# EAGLE design Terminierung_RS485-007 (EAGLE 7.6.0)
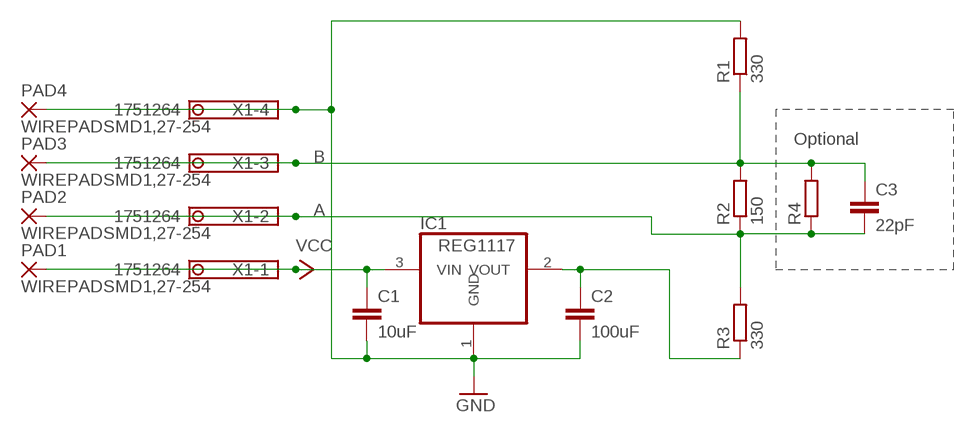
[diagram p0: schematic, sheet 1]

## Parts
C1  10uF  C-EUC0805K  [C0805K]
C2  100uF  C-EUC0805K  [C0805K]
C3  22pF  C-EUC0805K  [C0805K]
IC1  REG1117  [SOT223]
PAD1  WIREPADSMD1,27-254  [SMD1,27-2,54]
PAD2  WIREPADSMD1,27-254  [SMD1,27-2,54]
PAD3  WIREPADSMD1,27-254  [SMD1,27-2,54]
PAD4  WIREPADSMD1,27-254  [SMD1,27-2,54]
R1  330  R-EU_R0805  [R0805]
R2  150  R-EU_R0805  [R0805]
R3  330  R-EU_R0805  [R0805]
R4  R-EU_M1206  [M1206]
X1  1751264  [1751264]

## Nets
A: C3.2 PAD2.1(P) R2.1 R3.2 R4.1 X1.2
B: C3.1 PAD3.1(P) R1.1 R2.2 R4.2 X1.3
GND [Power]: C1.2 C2.2 IC1.1(GND) PAD4.1(P) R1.2 X1.4
N$2: C2.1 IC1.2(VOUT) R3.1
VCC [Power]: C1.1 IC1.3(VIN) PAD1.1(P) X1.1

## Notes on the sheet
- Optional

## Library data of the parts
C1-C3 = resistor:C-EU: CAPACITOR, European symbol
IC1 = burr-brown:REG1117: 800mA and 1A Low Dropout (LDO) Positive Regulator 1.8V, 2.5V, 2.85V, 3.3V, 5V, and Adj; MPN: REG1117; OC_FARNELL: 1097566; OC_NEWARK: 14P6981
PAD1-PAD4 = wirepad:WIREPAD: Wire PAD connect wire on PCB
R1-R4 = resistor:R-EU_: RESISTOR, European symbol
X1 = con-phoenix-350:1751264: MKDS 1/ 4-3,5 Printklemme Nennstrom: 10 A Bemessungsspannung: 160 V Raster: 3,5 mm Polzahl: 4 Montageart: Löten Anschlussart: Schraubanschluss Anschlussrichtung vom Leiter zur Platine: 0° Source: http://eshop.phoenixcontact.com .. 1751264.pdf; MF: VIN; MPN: 1751264; OC_FARNELL: unknown; OC_NEWARK: 10R0934

## Net classes
0 default: width 0.406 mm
1 Power: width 0.61 mm

## Board
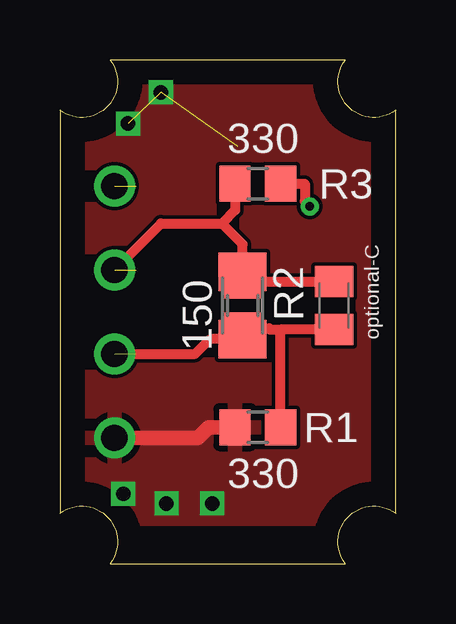
[diagram p1: board, top side]
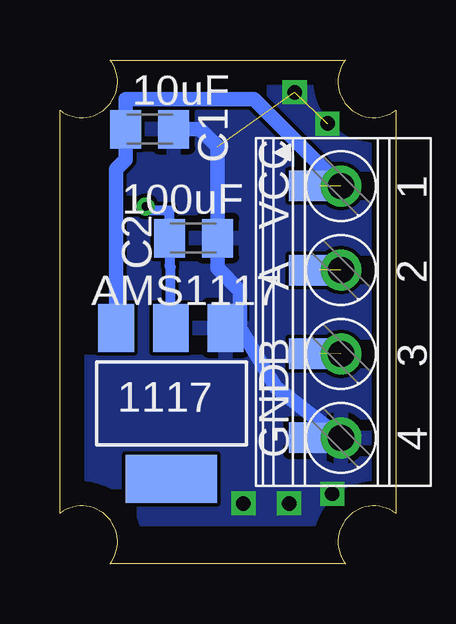
[diagram p2: board, bottom side, seen from below]

Size 14 x 21 mm. Coordinates in mm from the lower left corner, seen from the top.
Outline: 0,2.1 arc-164 2.1,0 11.9,0 arc-164 14,2.1 14,18.9 arc-164 11.9,21 2.1,21 arc-164 0,18.9 0,2.1
Copper layers (1*16): Top 0.035mm / dielectric 1.5mm / Bottom 0.035mm
Design rules "default": minimum track width 6mil, minimum drill 0.35mm, track to track 6mil, track to pad 6mil, pad to pad 6mil, via to via 6mil, smd to smd 6mil, copper to edge 40mil, drill to drill 6mil, minimum pad ring 10mil, minimum via ring 8mil, stop-mask expansion 4mil, vias tented up to drill 0mil, thermal gap 10mil

### Footprints (pad centres in the part's own frame; a part is rotated, then mirrored left to right if it is on the bottom)
C0805K = smd 1.3 x 1.6: 1 -1,0; 2 1,0
SOT223 = smd 1.499 x 2.007: 1 -2.261,-3.15; 2 0.025,-3.15; 3 2.311,-3.15 | smd 3.81 x 2.007: 4 0,3.15
SMD1,27-2,54 = smd 1.27 x 2.54: 1 0,0
R0805 = smd 1.3 x 1.5: 1 -0.95,0; 2 0.95,0
M1206 = smd 1.6 x 2: 1 -1.4,0; 2 1.4,0
1751264 = drill 1.1 pad 1.7: 1 -5.25,-0.1; 2 -1.75,-0.1; 3 1.75,-0.1; 4 5.25,-0.1

### Placement (x,y rotation side)
C1  10.26,18.11 0 bottom
C2  8.43,13.57 0 bottom
C3  11.43,10.76 90 top
IC1  9.35,6.68 180 bottom
PAD1  3.17,15.74 90 bottom
PAD2  3.17,12.23 90 bottom
PAD3  3.17,8.75 90 bottom
PAD4  3.17,5.24 90 bottom
R1  8.26,5.68 180 top
R2  7.62,10.76 270 top
R3  8.26,15.84 180 top
R4  7.62,10.76 270 top
X1  2.17,10.49 270 bottom

### Tracks (layer width: path | path; a pad name or v marks a point on that pad's centre or on a via)
A  (1 unrouted)
  Top 0.406: 7.62,11.76 R4.1 7.62,13.32 6.75,14.18 | R2.1 7.62,11.76 | 7.62,11.76 C3.2 | X1.2 4.22,14.18 6.75,14.18 | 6.75,14.18 7.3,14.73 R3.2
B  (1 unrouted)
  Top 0.406: 7.17,9.36 R2.2 8.73,9.81 8.78,9.76 9.21,9.76 | R4.2 7.17,9.36 | 7.17,9.36 6.26,9.36 5.64,8.74 X1.3 | R1.1 9.21,9.76 | C3.1 9.21,9.76
GND  (via drill 0.6)  (2 unrouted)
  Top 0.61: R1.2 6.2,5.68 5.76,5.24 X1.4
  Bottom 0.61: X1.4 4.99,7.35 6.49,9.83 | 6.49,9.83 6.49,11.37 7.43,12.31 C2.2 7.43,17.39 8.15,18.11 C1.2 | IC1.1 6.49,9.83
  other vias: 2.84,18.35 4.21,19.65 2.64,2.91 4.45,2.5 6.35,2.5
  pour Top: 1.27,1.87 1.27,20.92 12.7,20.92 12.7,1.87
  pour Bottom: 1.27,1.87 1.27,20.92 12.7,20.92 12.7,1.87
N$2  (via drill 0.35 pad 0.76)
  Top 0.406: R3.1 10.21,15.84 10.21,15.1 v10.42,14.89
  Bottom 0.406: v10.42,14.89 10.26,14.73 9.43,14.73 C2.1 9.43,12.41 9.38,12.36 IC1.2
VCC  (1 unrouted)
  Bottom 0.61: X1.1 5.9,19.37 11.26,19.37 C1.1 11.26,16.85 11.66,16.45 IC1.3

### Text on the board
tNames: 330 | R3 | optional-C | R2 | 150 | R1 | 330
bNames: 10uF | C1 | 100uF | C2 | VCC | A | AMS1117 | B | 1117 | GND